# EAGLE schematic gatilhov1 (EAGLE 7.5.0)
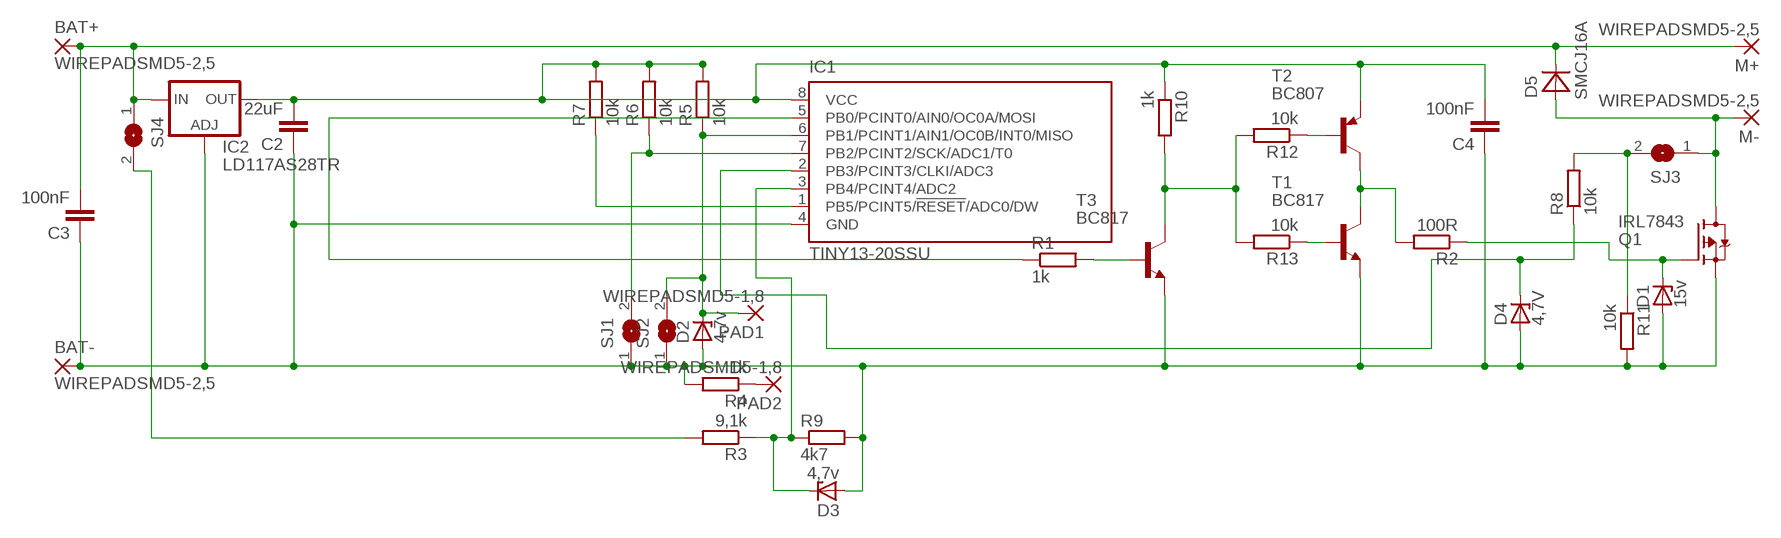
[diagram p0: schematic, sheet 1]

## Parts
BAT+  WIREPADSMD5-2,5  [5-2,5]
BAT-  WIREPADSMD5-2,5  [5-2,5]
C2  22uF  C-EUC1210K  [C1210K]
C3  100nF  C-EUC0805K  [C0805K]
C4  100nF  C-EUC1206K  [C1206K]
D1  15v  ZENER-DIODESOD80C  [SOD80C]
D2  4,7v  ZENER-DIODESOD80C  [SOD80C]
D3  4,7v  ZENER-DIODESOD80C  [SOD80C]
D4  4,7V  ZENER-DIODESOD80C  [SOD80C]
D5  SMCJ16A  MBRA340T3  [SMA]
IC1  TINY13-20SSU  [8S1]
IC2  LD117AS28TR  [SOT223]
M+  WIREPADSMD5-2,5  [5-2,5]
M-  WIREPADSMD5-2,5  [5-2,5]
PAD1  WIREPADSMD5-1,8  [5-1,8]
PAD2  WIREPADSMD5-1,8  [5-1,8]
Q1  IRL7843  FDD4141TO252  [TO252]
R1  1k  R-EU_R0805  [R0805]
R2  100R  R-EU_R0805  [R0805]
R3  9,1k  R-EU_R0805  [R0805]
R4  1k  R-EU_R0805  [R0805]
R5  10k  R-EU_R0805  [R0805]
R6  10k  R-EU_R0805  [R0805]
R7  10k  R-EU_R0805  [R0805]
R8  10k  R-EU_R0805  [R0805]
R9  4k7  R-EU_R0805  [R0805]
R10  1k  R-EU_R0805  [R0805]
R11  10k  R-EU_R0805  [R0805]
R12  10k  R-EU_R0805  [R0805]
R13  10k  R-EU_R0805  [R0805]
SJ1  SJ  [SJ]
SJ2  SJ  [SJ]
SJ3  SJ  [SJ]
SJ4  SJ  [SJ]
T1  BC817  MMBT3904LT1-NPN-SOT23-BEC  [SOT23-BEC]
T2  BC807  MMBT3906LT1-PNP-SOT23-BEC  [SOT23-BEC]
T3  BC817  MMBT3904LT1-NPN-SOT23-BEC  [SOT23-BEC]

## Nets
N$1: BAT-.1(P) C2.1 C3.1 C4.1 D1.A D2.A D3.A D4.A IC1.4(GND) IC2.1(ADJ) Q1.2(S) R4.2 R9.2 R11.2 SJ1.1 SJ2.1 T1.E T3.E
N$2: D5.A M-.1(P) Q1.3(D) SJ3.1
N$4: PAD2.1(P) R4.1
N$5: D4.C IC1.2(PB3/PCINT3/CLKI/ADC3) R8.1
N$6: IC1.5(PB0/PCINT0/AIN0/OC0A/MOSI) R1.1
N$7: D2.C IC1.6(PB1/PCINT1/AIN1/OC0B/INT0/MISO) PAD1.1(P) R5.1 SJ2.2
N$8: D3.C IC1.3(PB4/PCINT4/ADC2) R3.1 R9.1
N$9: IC1.7(PB2/PCINT2/SCK/ADC1/T0) R6.1 SJ1.2
N$10: IC1.1(PB5/PCINT5/!RESET!/ADC0/DW) R7.1
N$11: R10.2 R12.2 R13.2 T3.C
N$12: R1.2 T3.B
N$13: R2.2 T1.C T2.C
N$14: BAT+.1(P) C3.2 D5.C IC2.3(IN) M+.1(P) SJ4.1
N$15: R12.1 T2.B
N$16: R13.1 T1.B
N$17: D1.C Q1.1(G) R2.1
N$18: R3.2 SJ4.2
N$19: R8.2 R11.1 SJ3.2
N$20: C2.2 C4.2 IC1.8(VCC) IC2.4(OUT) R5.2 R6.2 R7.2 R10.1 T2.E

## Library data of the parts
BAT+ BAT- M+ M- PAD1 PAD2 = wirepad:WIREPAD: Wire PAD connect wire on PCB
C2-C4 = rcl:C-EU: CAPACITOR, European symbol
D1-D4 = diode:ZENER-DIODE: Z-Diode
D5 = diode:MBRA340T3: Surface Mount Schottky Power Rectifier Source: http://www.onsemi.com/pub_link/Collateral/MBRA340T3-D.PDF
IC1 = atmel:TINY13: 8-bit AVR Microcontroller with 1K Bytes In-System Programmable Flash Source: http://www.atmel.com/dyn/resources/prod_documents/2535S.pdf; MPN: ATTINY13-20SSU; OC_FARNELL: 1455133; OC_NEWARK: 58M3771
IC2 = v-reg:LD117A?*: Low drop fixed and adjustable positive voltage regulators 1 A Source: http://www.st.com/stonline/products/literature/ds/7194/ld1117axx.pdf
Q1 = transistor-fet:FDD4141: P-Channel PowerTrench® MOSFET Source: FDD4141.pdf
R1-R13 = resistor:R-EU_: RESISTOR, European symbol
SJ1-SJ4 = jumper:SJ: SMD solder JUMPER
T1 T3 = transistor-neu-to92:*-NPN-: NPN Transistror
T2 = transistor:*-PNP-: PNP Transistror